# EAGLE schematic DroneBoard (EAGLE 7.7.0)
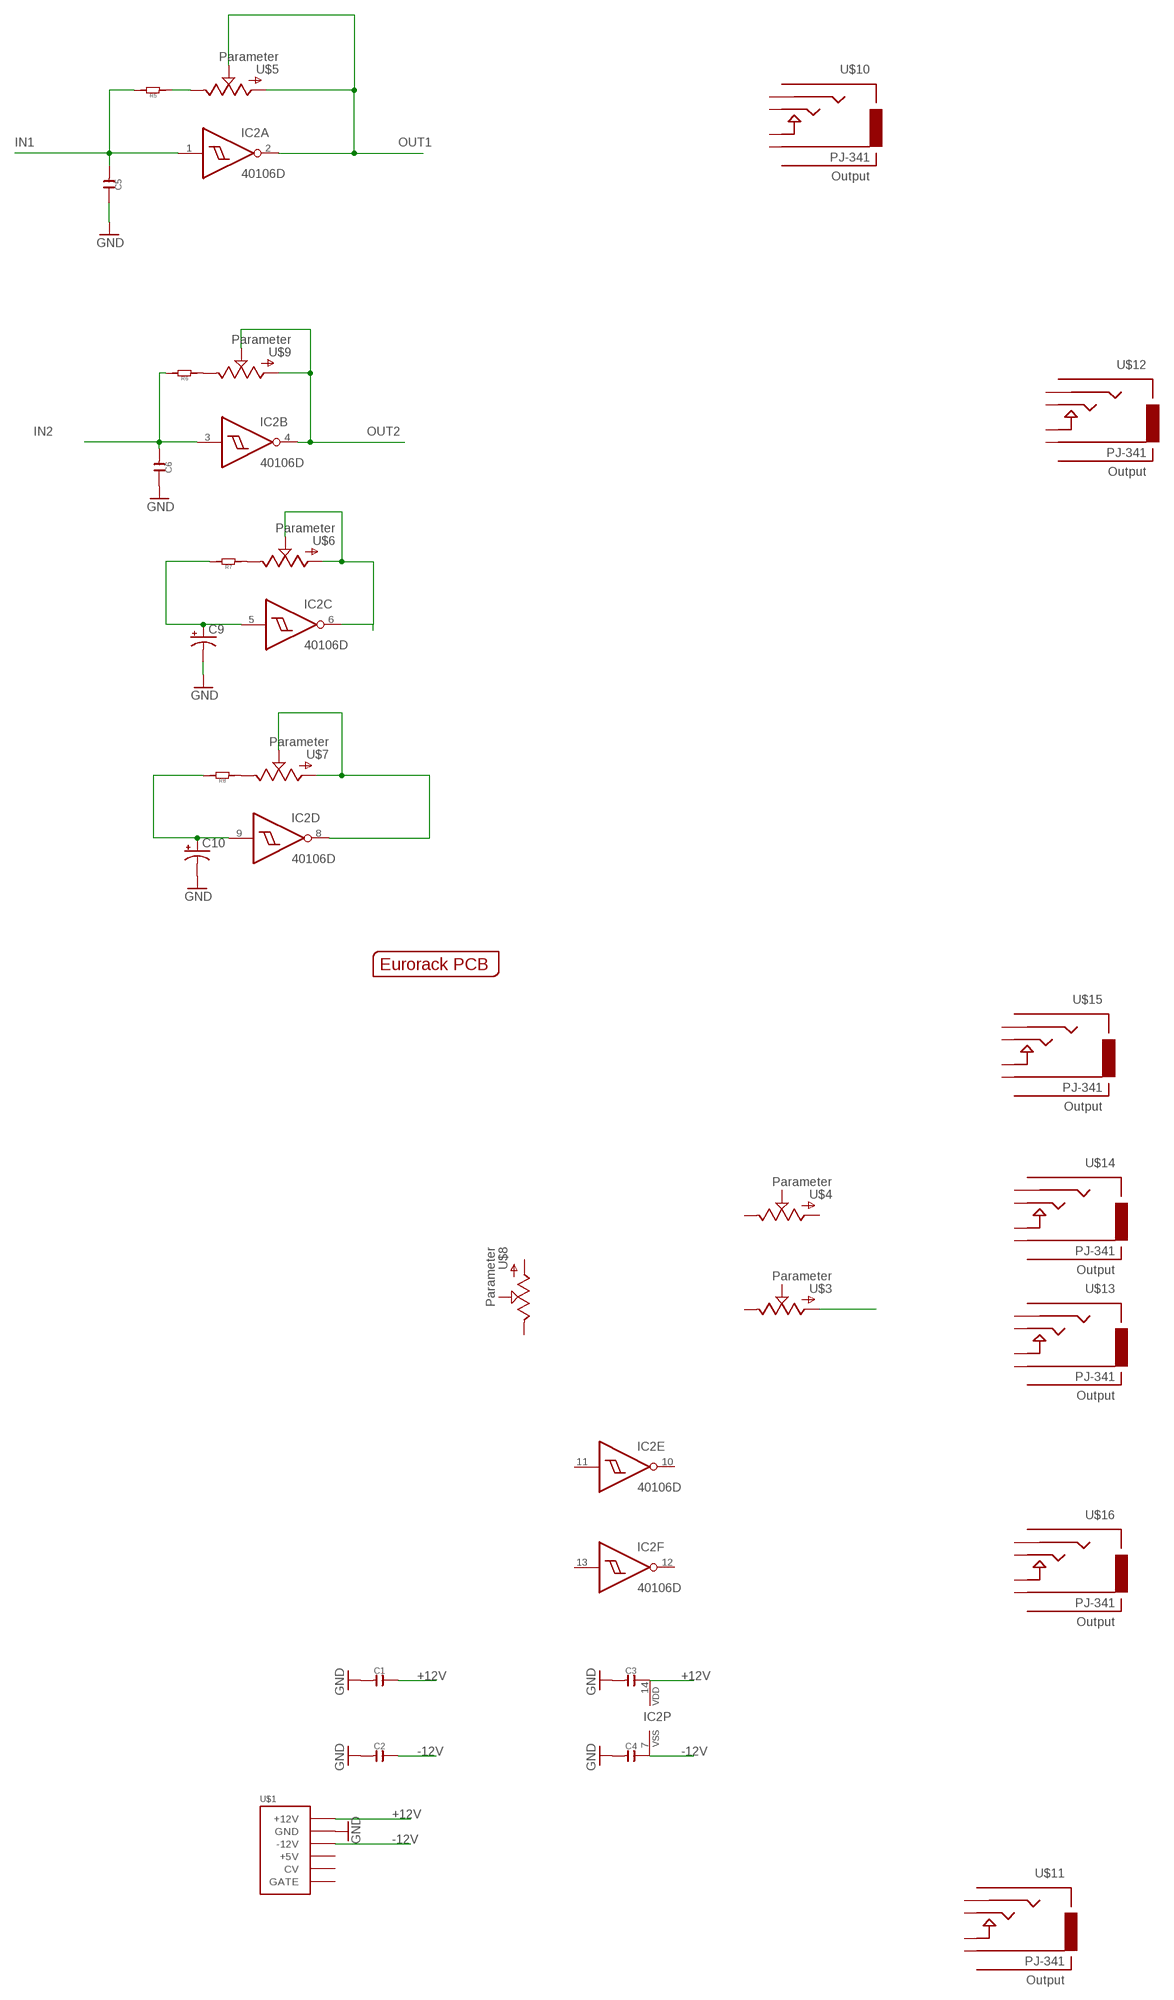
[diagram p0: schematic, sheet 1]

## Parts
C1  C-0603  [C0603]
C2  C-0603  [C0603]
C3  C-0603  [C0603]
C4  C-0603  [C0603]
C5  C-0603  [C0603]
C6  C-0603  [C0603]
C9  CPOL-US153CLV-0505  [153CLV-0505]
C10  CPOL-US153CLV-0505  [153CLV-0505]
IC2  40106D  [SO14]
R5  R-0603  [R0603]
R6  R-0603  [R0603]
R7  R-0603  [R0603]
R8  R-0603  [R0603]
U$1  POWERSHROUDED  [POWER_16_SHROUDED]
U$2  EURORACK_PCB8HP  [EURORACK8HPPCB]
U$3  POTZEPHPOT  [OG-POTS_ALPS_POT_VERTICAL]
U$4  POTZEPHPOT  [OG-POTS_ALPS_POT_VERTICAL]
U$5  POTZEPHPOT  [OG-POTS_ALPS_POT_VERTICAL]
U$6  POTZEPHPOT  [OG-POTS_ALPS_POT_VERTICAL]
U$7  POTZEPHPOT  [OG-POTS_ALPS_POT_VERTICAL]
U$8  POTZEPHPOT  [OG-POTS_ALPS_POT_VERTICAL]
U$9  POTZEPHPOT  [OG-POTS_ALPS_POT_VERTICAL]
U$10  PJ-341  AUDIO-JACKOUTPUT  [3.5MM-JACK-SWITCH-13MM-OUTPUT]
U$11  PJ-341  AUDIO-JACKOUTPUT  [3.5MM-JACK-SWITCH-13MM-OUTPUT]
U$12  PJ-341  AUDIO-JACKOUTPUT  [3.5MM-JACK-SWITCH-13MM-OUTPUT]
U$13  PJ-341  AUDIO-JACKOUTPUT  [3.5MM-JACK-SWITCH-13MM-OUTPUT]
U$14  PJ-341  AUDIO-JACKOUTPUT  [3.5MM-JACK-SWITCH-13MM-OUTPUT]
U$15  PJ-341  AUDIO-JACKOUTPUT  [3.5MM-JACK-SWITCH-13MM-OUTPUT]
U$16  PJ-341  AUDIO-JACKOUTPUT  [3.5MM-JACK-SWITCH-13MM-OUTPUT]

## Nets
+12V: C1.2 C3.2 IC2.14(P:VDD) U$1.9(+12V) U$1.10(+12V)
-12V: C2.2 C4.2 IC2.7(P:VSS) U$1.1(-12V) U$1.2(-12V)
GND: C1.1 C2.1 C3.1 C4.1 C5.2 C6.2 C9.- C10.- U$1.3(GND) U$1.4(GND) U$1.5(GND) U$1.6(GND) U$1.7(GND) U$1.8(GND)
IN1: C5.1 IC2.1(A:I) R5.2
IN2: C6.1 IC2.3(B:I) R6.2
N$5: U$3.P$3(A)
N$6: C9.+ IC2.5(C:I) R7.2
N$7: IC2.8(D:O) U$7.P$2(S) U$7.P$3(A)
N$8: R5.1 U$5.P$1(E)
N$9: R6.1 U$9.P$1(E)
N$10: C10.+ IC2.9(D:I) R8.2
N$11: R7.1 U$6.P$1(E)
N$12: R8.1 U$7.P$1(E)
N$13: IC2.6(C:O) U$6.P$2(S) U$6.P$3(A)
OUT1: IC2.2(A:O) U$5.P$2(S) U$5.P$3(A)
OUT2: IC2.4(B:O) U$9.P$2(S) U$9.P$3(A)
Unconnected: IC2.10(E:O) IC2.11(E:I) IC2.12(F:O) IC2.13(F:I) U$1.11(+5V) U$1.12(+5V) U$1.13(CV) U$1.14(CV) U$1.15(GATE) U$1.16(GATE) U$3.P$1(E) U$3.P$2(S) U$4.P$1(E) U$4.P$2(S) U$4.P$3(A) U$8.P$1(E) U$8.P$2(S) U$8.P$3(A) U$10.RING@3(RING) U$10.SECOND@3(SECOND) U$10.SWITCH@3(SWITCH) U$10.TIP@3(TIP) U$11.RING@3(RING) U$11.SECOND@3(SECOND) U$11.SWITCH@3(SWITCH) U$11.TIP@3(TIP) U$12.RING@3(RING) U$12.SECOND@3(SECOND) U$12.SWITCH@3(SWITCH) U$12.TIP@3(TIP) U$13.RING@3(RING) U$13.SECOND@3(SECOND) U$13.SWITCH@3(SWITCH) U$13.TIP@3(TIP) U$14.RING@3(RING) U$14.SECOND@3(SECOND) U$14.SWITCH@3(SWITCH) U$14.TIP@3(TIP) U$15.RING@3(RING) U$15.SECOND@3(SECOND) U$15.SWITCH@3(SWITCH) U$15.TIP@3(TIP) U$16.RING@3(RING) U$16.SECOND@3(SECOND) U$16.SWITCH@3(SWITCH) U$16.TIP@3(TIP)

## Library data of the parts
C1-C6 = OPL:C*
C9 C10 = adafruit:CPOL-US: POLARIZED CAPACITOR, American symbol
IC2 = 40xx:40106: Hex SCHMITT TRIGGER
R5-R8 = OPL:R*
U$1 = EurorackModularParts:POWER
U$2 = EurorackModularParts:EURORACK_PCB
U$3-U$9 = EurorackModularParts:POT; DESC: Parameter
U$10-U$16 = EurorackModularParts:AUDIO-JACK: Switching Mono 3.5mm Audio Jack from Erthenvar.; DESC: Output; MPN: PJ-341